# EAGLE design mini_rotation (EAGLE 9.3.0)
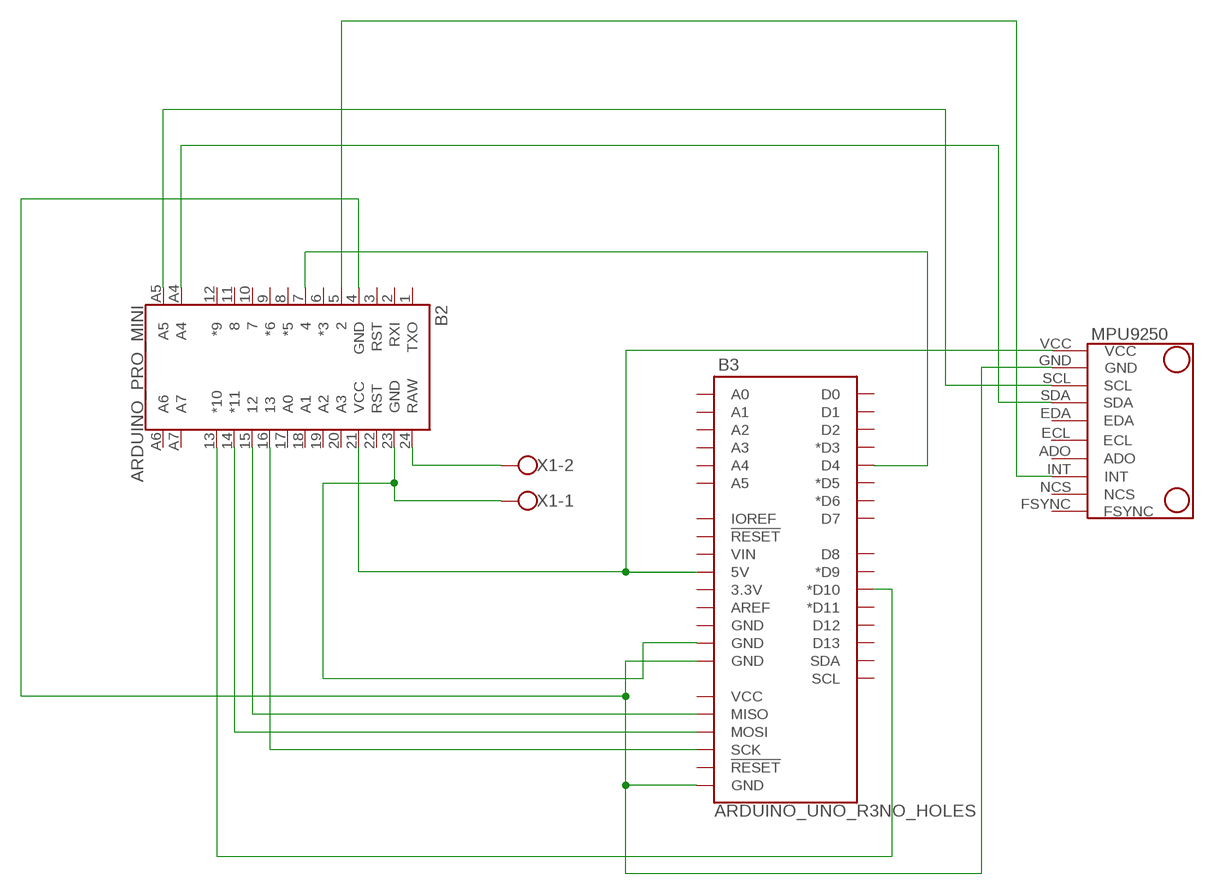
[diagram p0: schematic, sheet 1]

## Parts
B2  ARDUINO_PRO_MINI  [ARDUINO_PRO_MINI]
B3  ARDUINO_UNO_R3NO_HOLES  [ARDUINO_R3_NO_HOLES]
IC1  MPU9250  [MPU9250]
X1  W237-102  [W237-102]

## Nets
N$1: B2.7 B3.D4
N$3: B2.14(*11) B3.MOSI
N$4: B2.15 B3.MISO
N$5: B2.A4 IC1.SDA
N$6: B2.A5 IC1.SCL
N$7: B2.4(GND) B3.GND@1(GND) B3.GND@2(GND) IC1.GND
N$8: B2.24(RAW) X1.2
N$10: B2.16 B3.SCK
N$12: B2.13(*10) B3.D10(*D10)
N$13: B2.5 IC1.INT
N$14: B2.23(GND) B3.GND@3(GND) X1.1
N$15: B2.21(VCC) B3.5V IC1.VCC
Unconnected: B2.1(TXO) B2.2(RXI) B2.3(RST) B2.6(*3) B2.8(*5) B2.9(*6) B2.10 B2.11 B2.12(*9) B2.17(A0) B2.18(A1) B2.19(A2) B2.20(A3) B2.22(RST) B2.A6 B2.A7 B3.3.3V B3.A0 B3.A1 B3.A2 B3.A3 B3.A4 B3.A5 B3.AREF B3.D0 B3.D1 B3.D2 B3.D3(*D3) B3.D5(*D5) B3.D6(*D6) B3.D7 B3.D8 B3.D9(*D9) B3.D11(*D11) B3.D12 B3.D13 B3.GND@4(GND) B3.IOREF B3.RESET@1(!RESET!) B3.RESET@2(!RESET!) B3.SCL B3.SDA B3.VCC B3.VIN IC1.ADO IC1.ECL IC1.EDA IC1.FSYNC IC1.NCS

## Library data of the parts
B2 = SparkFun-Boards:ARDUINO_PRO_MINI: SparkFun Pro Mini Pro Mini compatible footprint. Dimensions: 0.7 x 1.3" PCB Thickness: 0.8mm SparkFun Products: 3.3V/8MHz <https://www.sparkfun.com/products/11114> 5V/16MHz <https://www.sparkfun.com/products/11113>
B3 = proMini:ARDUINO_UNO_R3: Arduino R3 Footprint with SPI header Arduino Uno R3 Compatible Footprint. Matches PCB size of the original board. SparkFun Products: SAMD21 Dev Breakout <https://www.sparkfun.com/products/13672> RedBoard <https://www.sparkfun.com/products/12757> R3 Stackable Headers <https://www.sparkfun.com/products/11417>
IC1 = MPU9250:MPU9250
X1 = con-wago-500:W237-102: WAGO SCREW CLAMP; MPN: 237-102; OC_FARNELL: unknown; OC_NEWARK: 70K9898

## Board
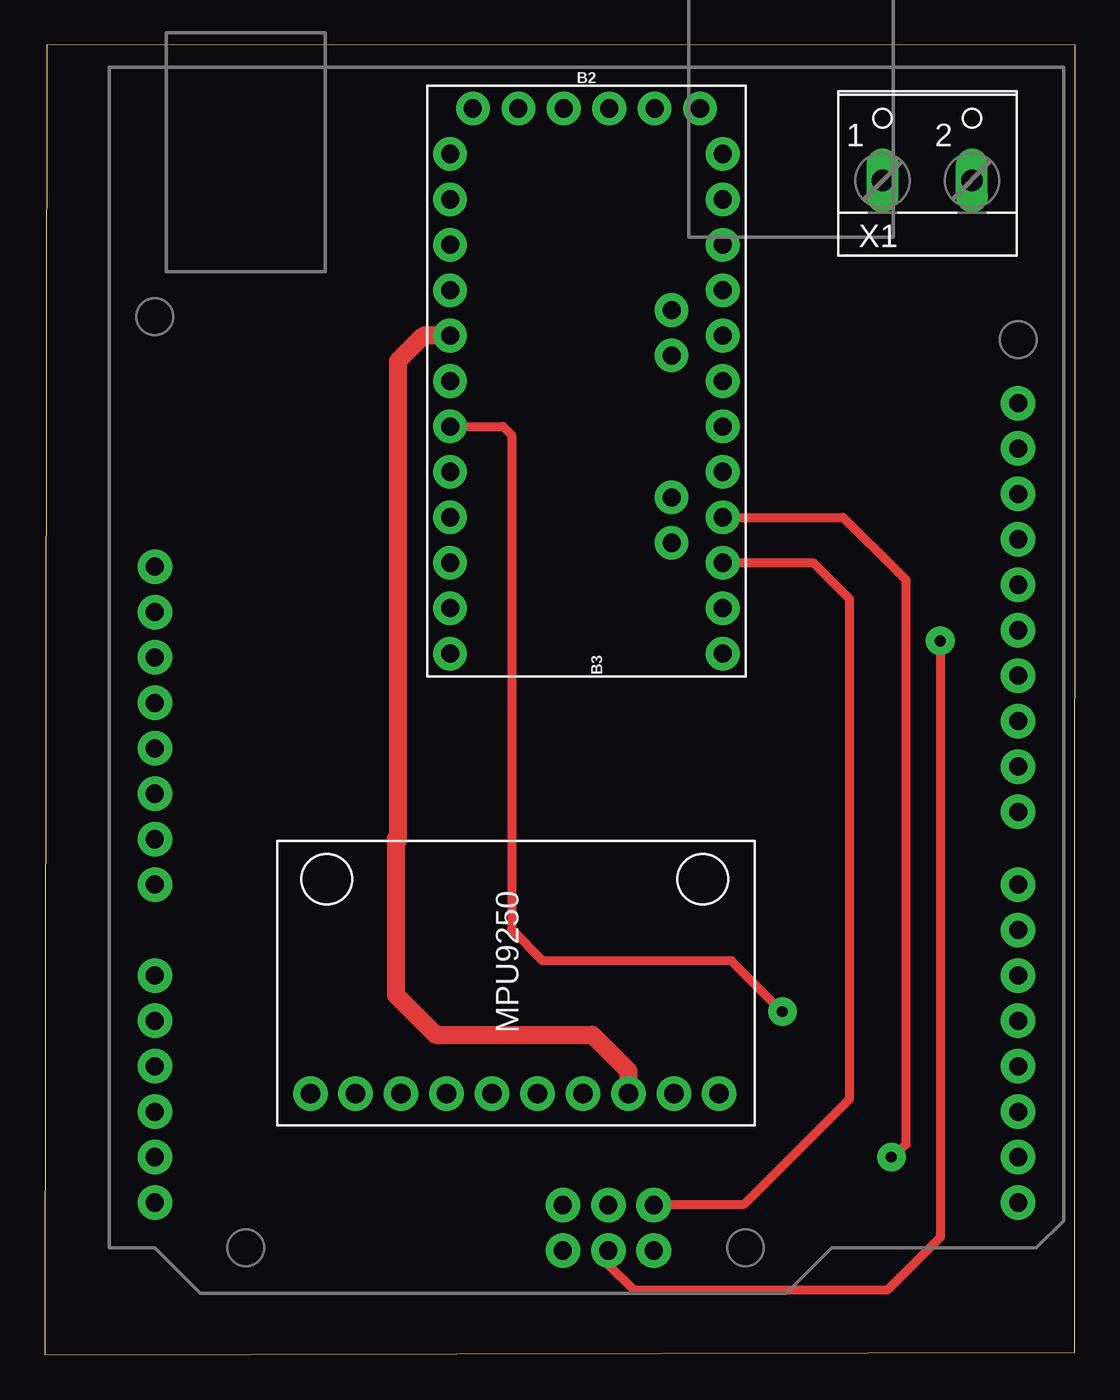
[diagram p1: board, top side]
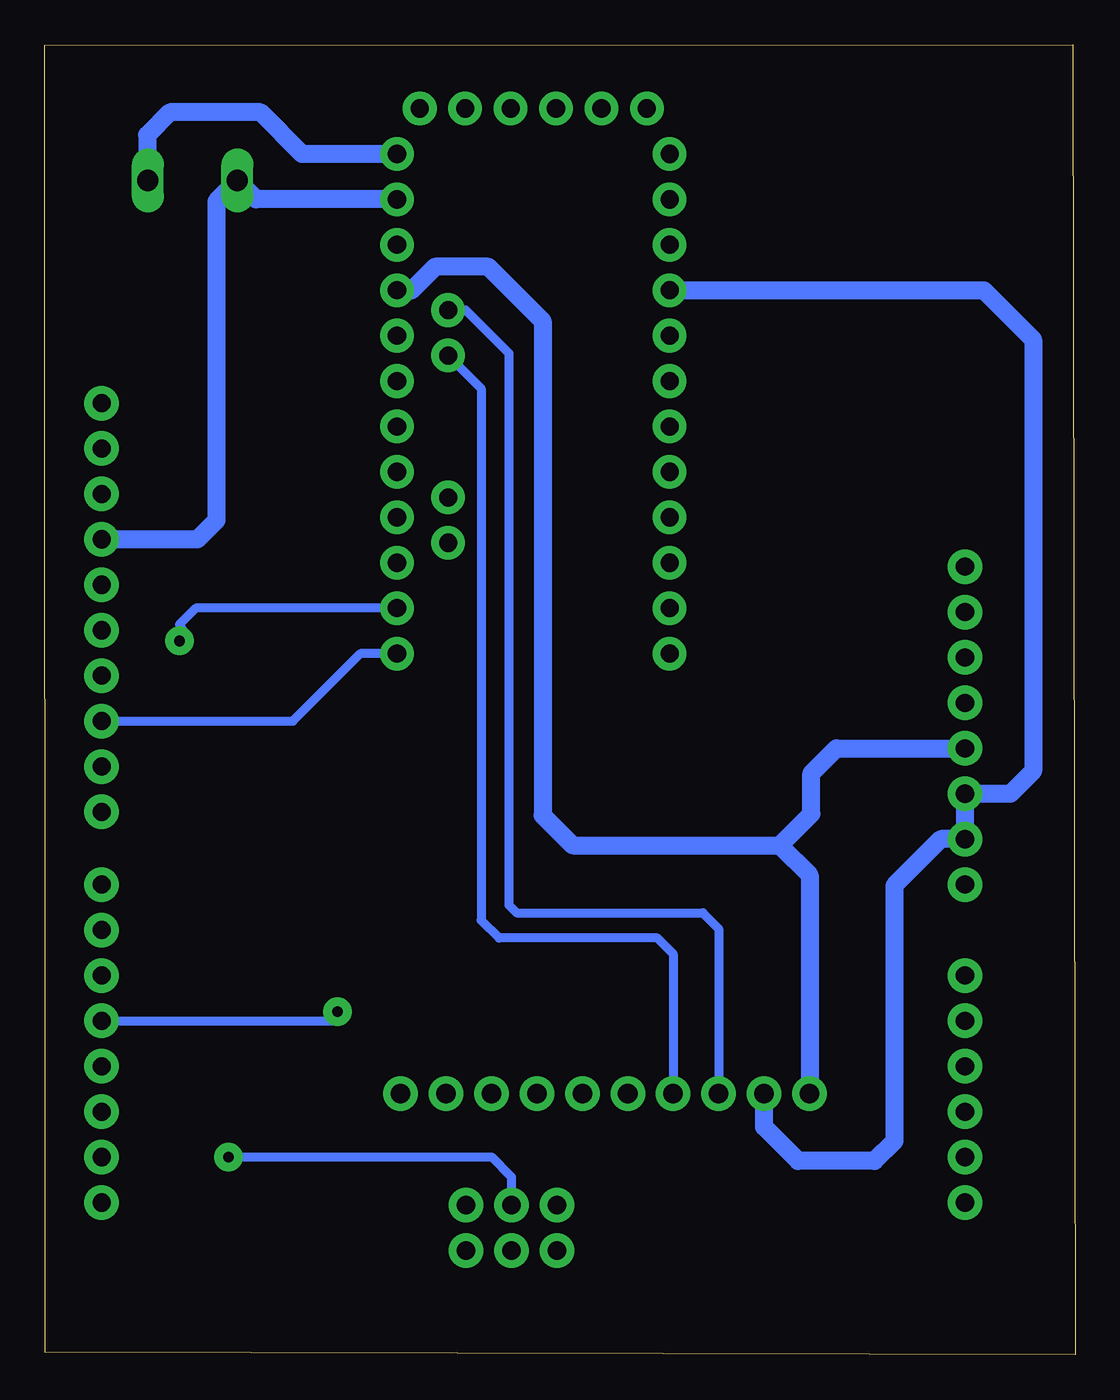
[diagram p2: board, bottom side, seen from below]

Size 57.6 x 73.26 mm. Coordinates in mm from the lower left corner, seen from the top.
Outline: 0,0 57.58,0.13 57.6,73.24 0.13,73.26 0,0
Copper layers (1*16): Top 0.018mm / dielectric 1.55mm / Bottom 0.018mm
Design rules "LPKF_GroepT(3)": minimum track width 0.5mm, minimum drill 0.6mm, track to track 0.2mm, track to pad 0.2mm, pad to pad 0.2mm, via to via 0.2mm, smd to smd 0mil, copper to edge 0.25mm, drill to drill 0.35mm, minimum pad ring 0.25mm, minimum via ring 0.5mm, stop-mask expansion 0mil, vias tented up to drill 0.45mm, thermal gap 0.2mm

### Footprints (pad centres in the part's own frame; a part is rotated, then mirrored left to right if it is on the bottom)
ARDUINO_PRO_MINI = drill 1.016 pad 1.88: 1 -7.62,12.7; 2 -7.62,10.16; 3 -7.62,7.62; 4 -7.62,5.08; 5 -7.62,2.54; 6 -7.62,0; 7 -7.62,-2.54; 8 -7.62,-5.08; 9 -7.62,-7.62; 10 -7.62,-10.16; 11 -7.62,-12.7; 12 -7.62,-15.24; 13 7.62,-15.24; 14 7.62,-12.7; 15 7.62,-10.16; 16 7.62,-7.62; 17 7.62,-5.08; 18 7.62,-2.54; 19 7.62,0; 20 7.62,2.54; 21 7.62,5.08; 22 7.62,7.62; 23 7.62,10.16; 24 7.62,12.7; A4 4.763,1.429; A5 4.763,3.969; A6 4.763,-9.049; A7 4.763,-6.509; BLK -6.35,15.24; GND -3.81,15.24; GRN 6.35,15.24; RXI 1.27,15.24; TXO 3.81,15.24; VCC -1.27,15.24
ARDUINO_R3_NO_HOLES = drill 1.016 pad 1.93: 3.3V 1.27,-24.13; 5V 3.81,-24.13; A0 16.51,-24.13; A1 19.05,-24.13; A2 21.59,-24.13; A3 24.13,-24.13; A4 26.67,-24.13; A5 29.21,-24.13; AREF -10.414,24.13; D0 29.21,24.13; D1 26.67,24.13; D2 24.13,24.13; D3 21.59,24.13; D4 19.05,24.13; D5 16.51,24.13; D6 13.97,24.13; D7 11.43,24.13; D8 7.366,24.13; D9 4.826,24.13; D10 2.286,24.13; D11 -0.254,24.13; D12 -2.794,24.13; D13 -5.334,24.13; GND@1 6.35,-24.13; GND@2 8.89,-24.13; GND@3 -7.874,24.13; GND@4 31.89,-1.32; IOREF -3.81,-24.13; MISO 29.35,3.76; MOSI 31.89,1.22; NC -6.35,-24.13; RESET@1 -1.27,-24.13; RESET@2 29.35,-1.32; SCK 29.35,1.22; SCL -15.494,24.13; SDA -12.954,24.13; VCC 31.89,3.76; VIN 11.43,-24.13
MPU9250 = drill 1.092 pad 1.93: ADO 1,-16.31; ECL 1,-13.77; EDA 1,-11.23; FSYNC 1,-23.93; GND 1,-3.61; INT 1,-18.85; NCS 1,-21.39; SCL 1,-6.15; SDA 1,-8.69; VCC 1,-1.07
W237-102 = drill 1.194 long: 1 -2.5,-1.27; 2 2.5,-1.27

### Placement (x,y rotation side)
B2  30.28,54.45 0 top
B3  30.28,37.72 270 top
IC1  13.77,13.59 90 top
X1  49.33,66.93 0 top

### Tracks (layer width: path | path; a pad name or v marks a point on that pad's centre or on a via)
N$1  (via drill 0.6)
  Top 0.5: B2.7 25.62,51.91 26.09,51.44 26.09,23.77 27.84,22.03 38.39,22.03 v41.23,19.19
  Bottom 0.5: B3.D4 41.23,18.67 v41.23,19.19
N$3  (via drill 0.6)
  Top 0.5: B3.MOSI 31.5,5.05 32.91,3.64 47.12,3.64 50.06,6.58 v50.06,39.92
  Bottom 0.5: B2.14 49.14,41.75 50.06,40.83 arc80 v50.06,39.92
N$4
  Top 0.5: B2.15 42.96,44.29 44.99,42.26 44.99,14.3 39.1,8.42 34.09,8.42 B3.MISO
N$5
  Bottom 0.5: B2.A4 33.2,54.03 33.2,24.3 32.2,23.3 23.35,23.3 22.46,22.42 IC1.SDA
N$6
  Bottom 0.5: B2.A5 34.06,58.42 31.65,56 31.65,25.14 31.22,24.71 20.81,24.71 19.92,23.83 IC1.SCL
N$7
  Bottom 1: B2.4 5.1,59.53 2.34,56.77 2.34,32.64 3.61,31.37 B3.GND@1 B3.GND@2 7.51,28.83 10.1,26.24 10.1,11.95 11.21,10.83 15.48,10.83 17.38,12.74 IC1.GND
N$8
  Bottom 1: B2.24 43.2,67.15 45.52,69.47 50.6,69.47 51.87,68.2 51.87,65.7 X1.2
N$10  (via drill 0.6)
  Top 0.5: B2.16 44.64,46.83 47.71,43.76 47.93,43.54 48.14,43.33 48.14,11.77 47.43,11.06 v47.33,11.06
  Bottom 0.5: v47.33,11.06 32.61,11.06 31.5,9.95 B3.SCK
N$12
  Bottom 0.5: B3.D10 43.72,35.44 39.95,39.21 B2.13
N$13
  Top 1: B2.5 21.16,56.99 19.75,55.58 19.75,28.76 19.63,28.88 19.63,28.55 19.63,27.59 19.63,20.12 21.85,17.89 30.6,17.89 32.62,15.87 IC1.INT
N$14
  Bottom 1: B3.GND@3 49.06,45.6 48,46.66 48,64.5 X1.1 45.78,64.61 B2.23
N$15
  Bottom 1: B2.21 37.08,59.53 35.77,60.85 32.8,60.85 29.77,57.82 29.77,30.17 28.09,28.49 16.51,28.49 | 16.51,28.49 14.84,26.83 IC1.VCC | 16.51,28.49 14.74,30.25 14.74,32.51 13.34,33.91 B3.5V